# EAGLE design PCB-wPAWS-0.1 (EAGLE 9.6.2)
IGNORE_RENUMBER: TP
Assembly variants: LED DISPLAY, LED CIRCLE, Powered, PRO_C, BASIC, PRO_MICRO

## Sheet 1 of 2
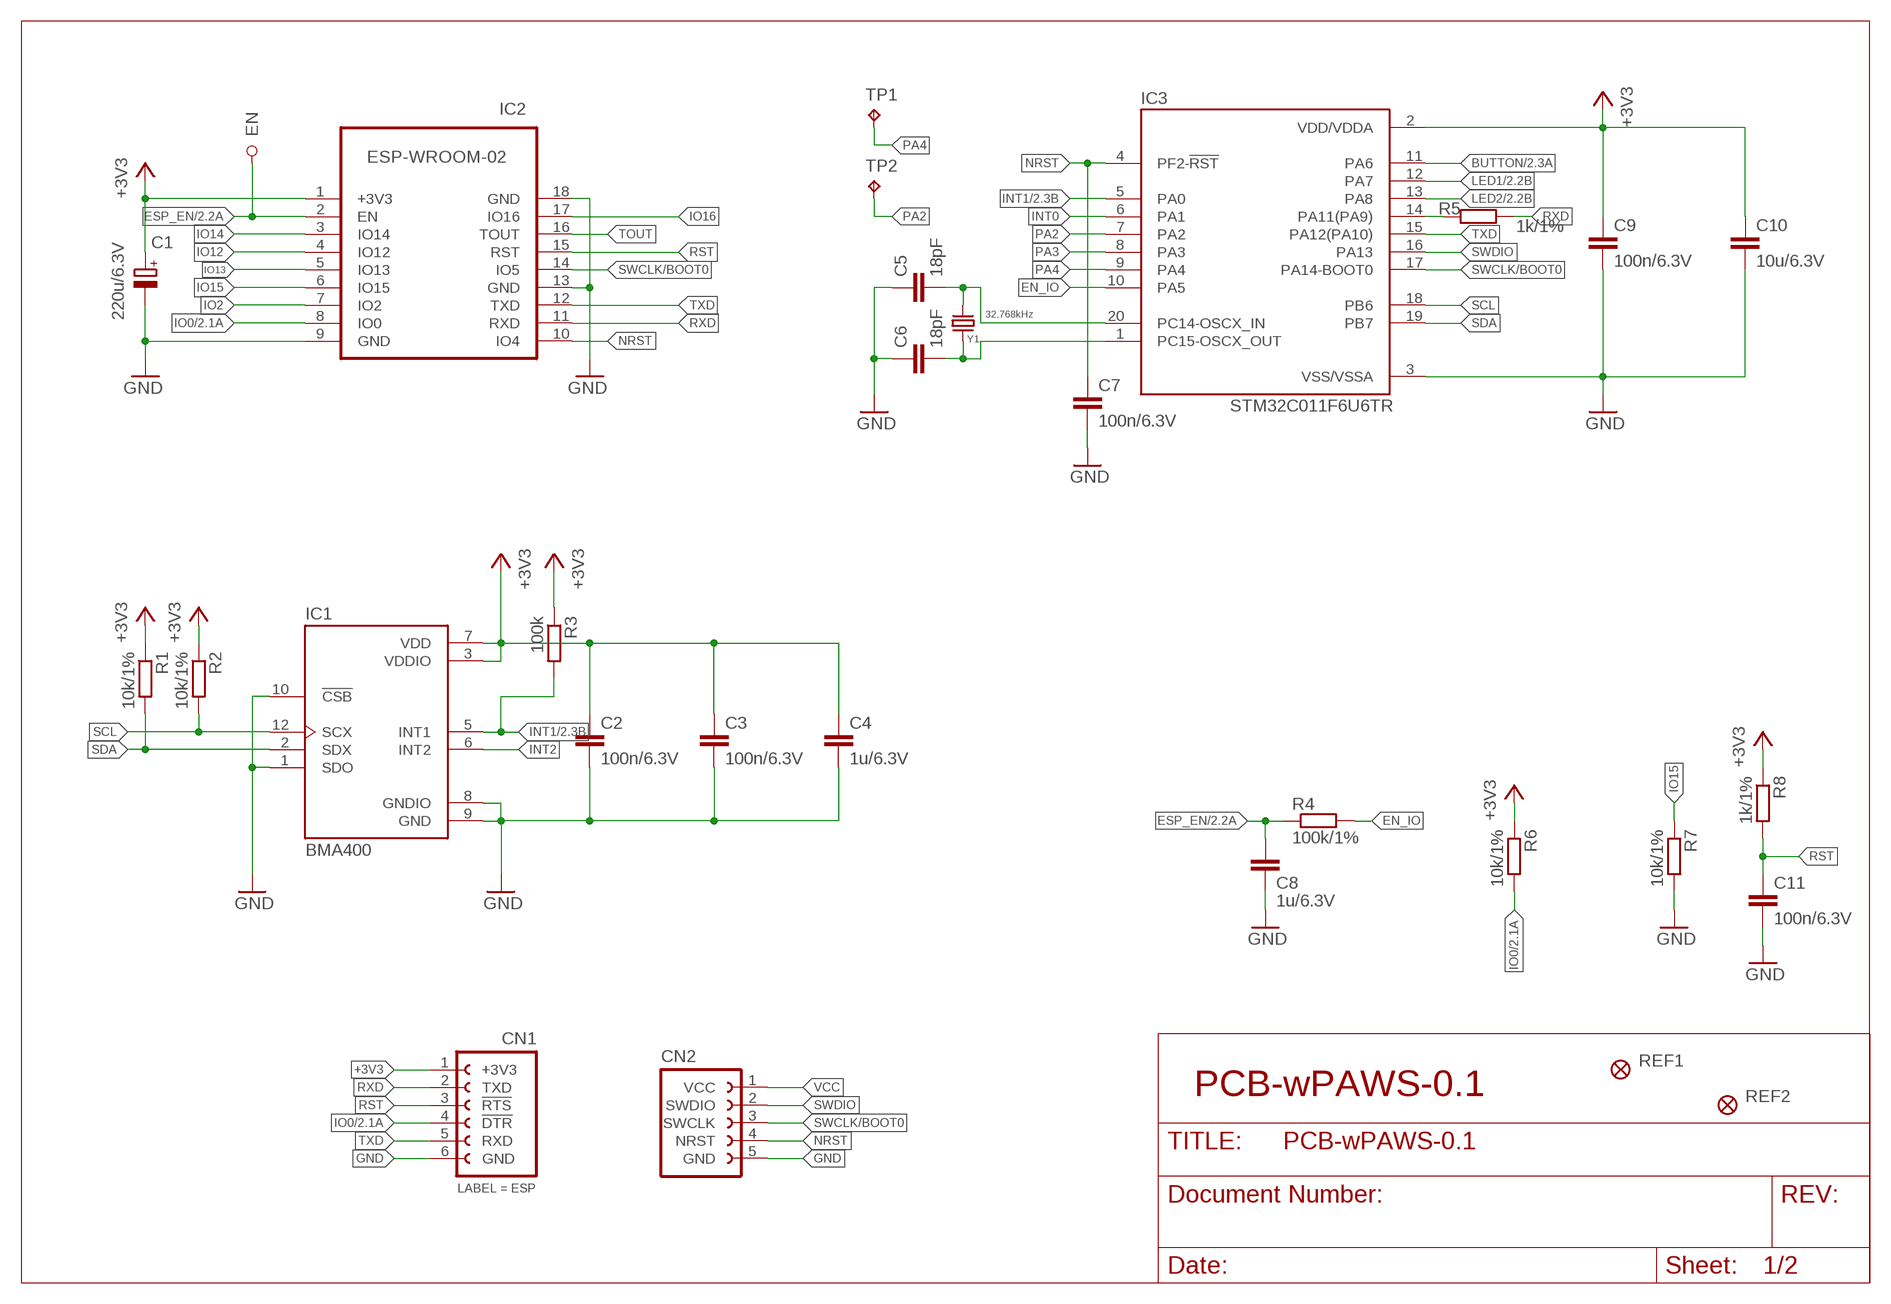
[diagram p0: schematic, sheet 1]

### Parts
C1  220u/6.3V  CPOL-EUSMCC  [SMC_C]
C2  100n/6.3V  C0402  [C0402]
C3  100n/6.3V  C0402  [C0402]
C4  1u/6.3V  C0402  [C0402]
C5  18pF  C0402  [C0402]
C6  18pF  C0402  [C0402]
C7  100n/6.3V  C0402  [C0402]
C8  1u/6.3V  C0402  [C0402]
C9  100n/6.3V  C0402  [C0402]
C10  10u/6.3V  C0402  [C0402]
C11  100n/6.3V  C0402  [C0402]
CN1  KOSMOPOLCENTERING-PADS  [6P-2.54-CENTERING-HOLE-PAD]
CN2  SWD2SIDE-CENTRING  [FE05W-SWD-CP]
IC1  BMA400  [XDCR_BMA400]
IC2  ESP-WROOM-02  ESP-WROOM-02D-32MBIT  [MODULE]
IC3  STM32C011F6U6TR  [IC_STM32C011F6U6TR]
JP1  PINHD-1X1  [1X01]
R1  10k/1%  R0402  [R0402]
R2  10k/1%  R0402  [R0402]
R3  100k  R0402  [R0402]
R4  100k/1%  R0402  [R0402]
R5  1k/1%  R0402  [R0402]
R6  10k/1%  R0402  [R0402]
R7  10k/1%  R0402  [R0402]
R8  1k/1%  R0402  [R0402]
REF1  FIDUCIAL-CLEAR  [FIDUCIAL-ANDPOL]
REF2  FIDUCIAL-CLEAR  [FIDUCIAL-ANDPOL]
TP1  TPB1,27  [B1,27]
TP2  TPB1,27  [B1,27]
Y1  32.768kHz  WE-XTAL_CFPX-217_830009706  [WE-XTAL_CFPX-217]

### Nets
+3V3: C1.+ C2.1 C3.1 C4.1 C9.1 C10.1 CN1.1(+3V3) IC1.3(VDDIO) IC1.7(VDD) IC2.1(+3V3) IC3.2(VDD/VDDA) R1.1 R2.1 R3.1 R6.1 R8.1 ; also sheet 2
BUTTON: IC3.11(PA6) ; also sheet 2
EN_IO: IC3.10(PA5) R4.2
ESP_EN: C8.1 IC2.2(EN) JP1.1 R4.1 ; also sheet 2
GND: C1.- C2.2 C3.2 C4.2 C5.1 C6.1 C7.2 C8.2 C9.2 C10.2 C11.2 CN1.6(GND) CN2.5(GND) IC1.1(SDO) IC1.8(GNDIO) IC1.9(GND) IC1.10(!CSB) IC2.9(GND) IC2.13(GND) IC2.18(GND) IC3.3(VSS/VSSA) R7.2 ; also sheet 2
INT0: IC3.6(PA1)
INT1: IC1.5(INT1) IC3.5(PA0) R3.2 ; also sheet 2
INT2: IC1.6(INT2)
IO0: CN1.4(!DTR) IC2.8(IO0) R6.2 ; also sheet 2
IO2: IC2.7(IO2)
IO12: IC2.4(IO12)
IO13: IC2.5(IO13)
IO14: IC2.3(IO14)
IO15: IC2.6(IO15) R7.1
IO16: IC2.17(IO16)
LED1: IC3.12(PA7) ; also sheet 2
LED2: IC3.13(PA8) ; also sheet 2
N$4: C6.2 IC3.1(PC15-OSCX_OUT) Y1.1
NRST: C7.1 CN2.4(NRST) IC2.10(IO4) IC3.4(PF2-!RST)
PA2: IC3.7(PA2) TP2.TP
PA3: IC3.8(PA3)
PA4: IC3.9(PA4) TP1.TP
PC14-OSCX_IN: C5.2 IC3.20(PC14-OSCX_IN) Y1.2
RST: C11.1 CN1.3(!RTS) IC2.15(RST) R8.2
RXD: CN1.2(TXD) IC2.11(RXD) R5.2
SCL: IC1.12(SCX) IC3.18(PB6) R2.2
SDA: IC1.2(SDX) IC3.19(PB7) R1.2
STM_RXD: IC3.14(PA11(PA9)) R5.1
SWCLK/BOOT0: CN2.3(SWCLK) IC2.14(IO5) IC3.17(PA14-BOOT0)
SWDIO: CN2.2(SWDIO) IC3.16(PA13)
TOUT: IC2.16(TOUT)
TXD: CN1.5(RXD) IC2.12(TXD) IC3.15(PA12(PA10))
VCC: CN2.1(VCC)

## Sheet 2 of 2
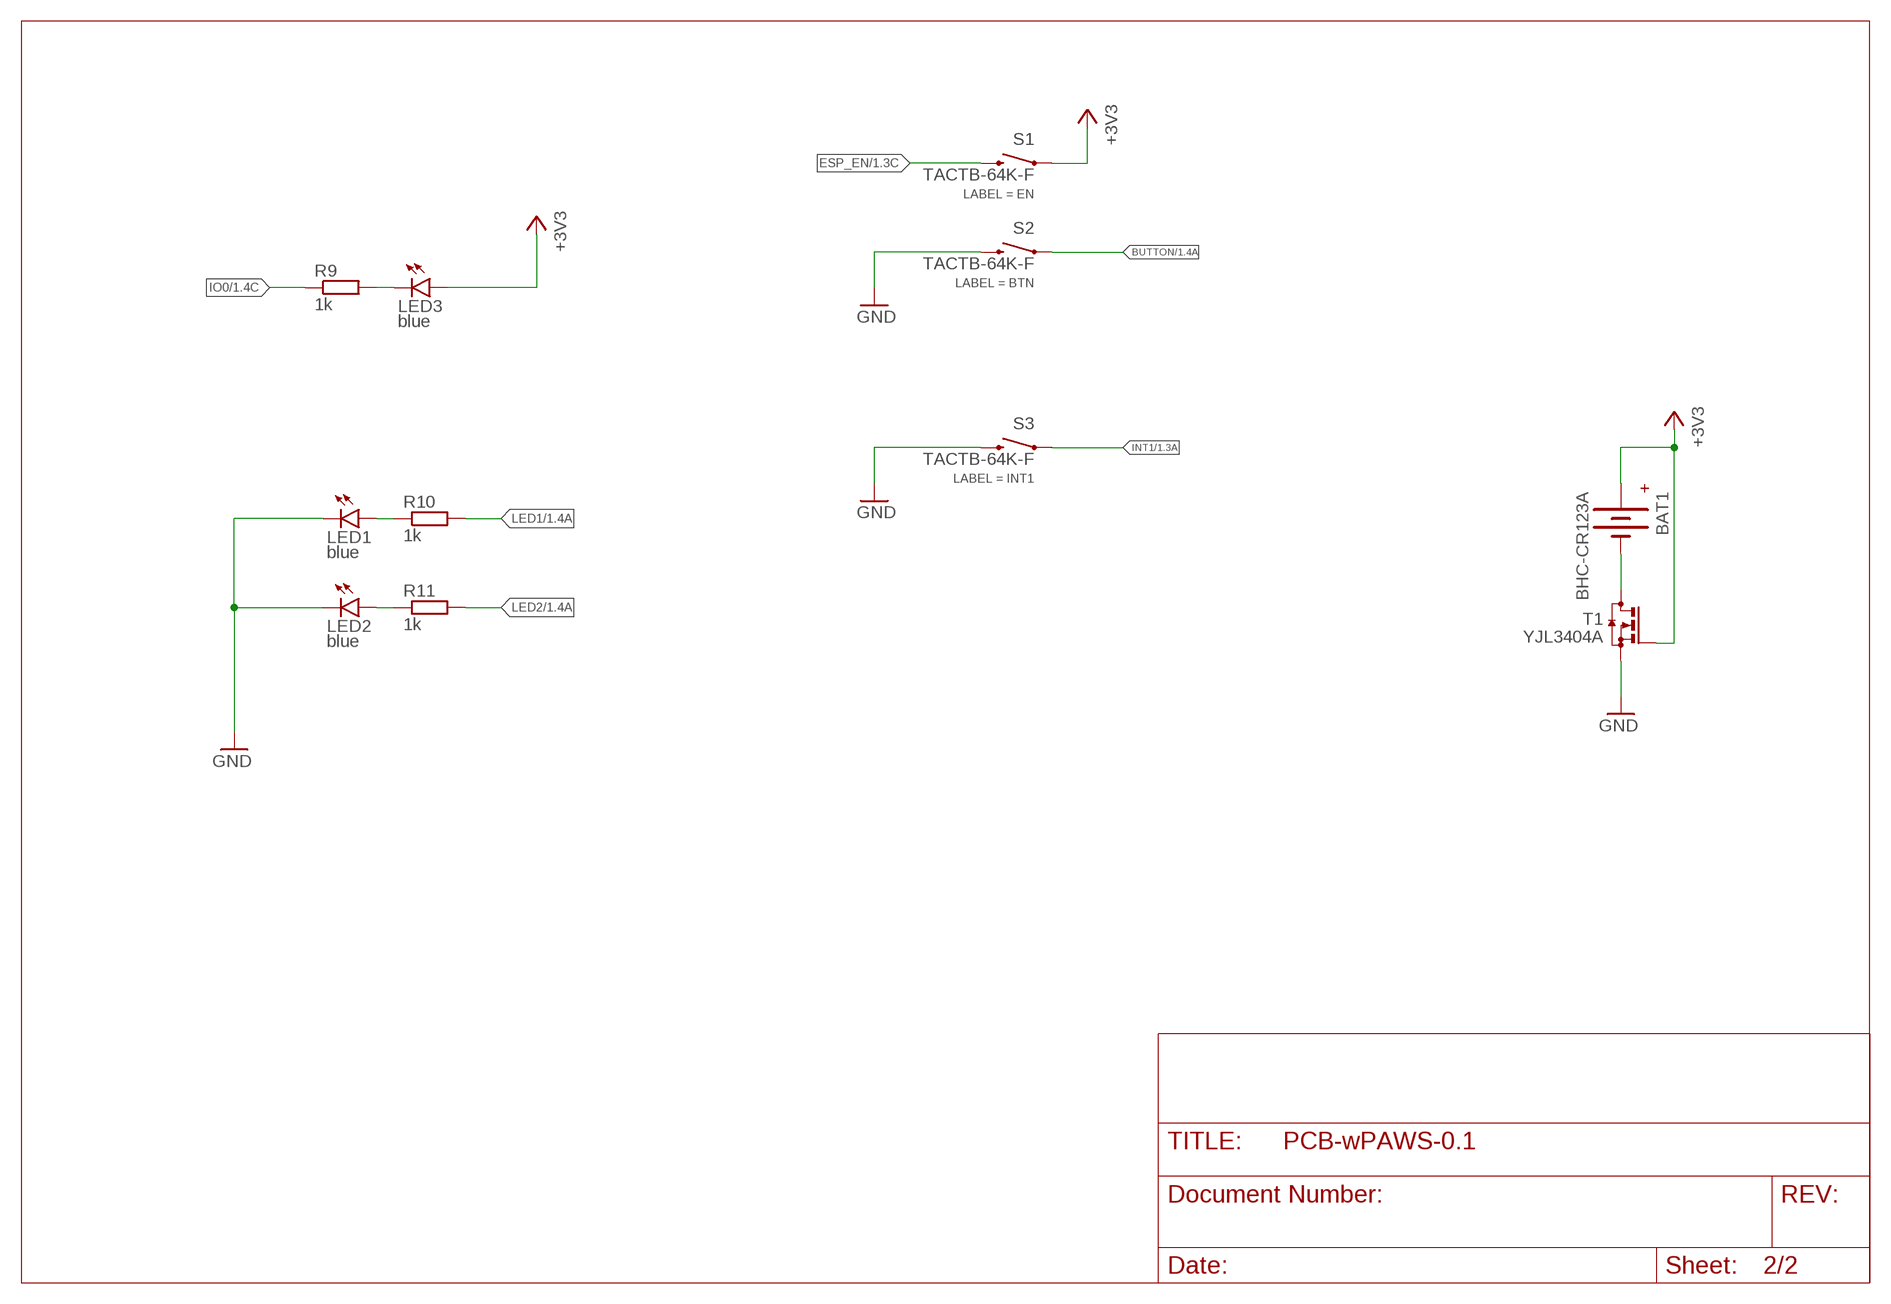
[diagram p1: schematic, sheet 2]

### Parts
BAT1  BHC-CR123A  BATTERYBHC-CR123A  [BHC-CR123A]
LED1  blue  LEDCHIPLED_0603  [CHIPLED_0603]  (not fitted in variant PRO_C)  (not fitted in variant BASIC)  (not fitted in variant PRO_MICRO)
LED2  blue  LEDCHIPLED_0603  [CHIPLED_0603]  (not fitted in variant PRO_C)  (not fitted in variant BASIC)  (not fitted in variant PRO_MICRO)
LED3  blue  LEDCHIPLED_0603  [CHIPLED_0603]  (not fitted in variant PRO_C)  (not fitted in variant BASIC)  (not fitted in variant PRO_MICRO)
R9  1k  R0402  [R0402]
R10  1k  R0402  [R0402]
R11  1k  R0402  [R0402]
S1  TACTB-64K-F  SWITCH-MOMENTARY-2SMD  [TACTILE-SWITCH-SMD]
S2  TACTB-64K-F  SWITCH-MOMENTARY-2SMD  [TACTILE-SWITCH-SMD]
S3  TACTB-64K-F  SWITCH-MOMENTARY-2SMD  [TACTILE-SWITCH-SMD]
T1  YJL3404A  MOSFET-N-SOT23  [SOT23-R_INFINEON]

### Nets
+3V3: BAT1.VCC(+) LED3.A S1.1 T1.1(G) ; also sheet 1
BUTTON: S2.1 ; also sheet 1
ESP_EN: S1.3 ; also sheet 1
GND: LED1.C LED2.C S2.3 S3.3 T1.2(S) ; also sheet 1
INT1: S3.1 ; also sheet 1
IO0: R9.1 ; also sheet 1
LED1: R10.2 ; also sheet 1
LED2: R11.2 ; also sheet 1
LED3C: LED3.C R9.2
N$1: BAT1.GND(-) T1.3(D)
N$2: LED2.A R11.1
N$3: LED1.A R10.1

## Library data of the parts
BAT1 = blebox-battery:BATTERY: Battery Holders Various common sizes : AA, AAA, 18650 (PRT-12895), 20mm coin cell and 12mm coin cell. 20MM_4LEGS, BATT-10373; OC_TME: BHC-CR123A; OC_TME_BATTERY: BAT-CR123/VA-BULK; PRICE_PLN: 1
C1 = rcl:CPOL-EU: POLARIZED CAPACITOR, European symbol; SPICEPREFIX: C
C2-C11 = blebox-rcl:C; PRICE_PLN: 0,02
CN1 = blebox-pinhead:KOSMOPOL: FEMALE HEADER; LABEL: ESP
CN2 = blebox-pinhead:SWD: FEMALE HEADER
IC1 = blebox-ic:BMA400; AVAILABILITY: Unavailable; DESCRIPTION: Accelerometer X, Y, Z Axis ±2g, 4g, 8g, 16g 12-LGA _2x2_; MF: Bosch Sensortec; MP: BMA400; PACKAGE: LGA-12 Bosch Tools; PRICE: None
IC2 = blebox-esp-wroom-02:ESP-WROOM-02: WiFi module - ESP-WROOM-02D 32MBit flash; OC_TME: ESP-WROOM-02; PRICE_PLN: 8,5
IC3 = blebox-ic:STM32C011F6U6TR; MANUFACTURER: STMicroelectronics; MAXIMUM_PACKAGE_HEIGHT: 0.6mm; PARTREV: 3; STANDARD: Manufacturer Recommendations
JP1 = blebox-pinhead:PINHD-1X1: PIN HEADER; TP_SIGNAL_NAME: EN
LED1-LED3 = led:LED: LED OSRAM: - CHIPLED LG R971, LG N971, LY N971, LG Q971, LY Q971, LO R971, LY R971 LH N974, LH R974 LS Q976, LO Q976, LY Q976 LO Q996 - Hyper CHIPLED LW Q18S LB Q993, LB Q99A, LB R99A - SideLED LS A670, LO A670, LY A670, LG A670, LP A670 LB A673, LV A673, LT A673, LW A673 LH A674 LY A675 LS A676, LA A676, LO A676, LY A676, LW A676 LS A679, LY A679, LG A679 - Hyper Micro SIDELED® LS Y876, LA Y876, LO Y876, LY Y876 LT Y87S - SmartLED LW L88C, LW L88S LB L89C, LB L89S, LG L890 LS L89K, LO L89K, LY L89K LS L896, LA L896, LO L896, LY L896 - TOPLED LS T670, LO T670, LY T670, LG T670, LP T670 LSG T670, LSP T670, LSY T670, LOP T670, LYG T670 LG T671, LOG T671, LSG T671 LB T673, LV T673, LT T673, LW T673 LH T674 LS T676, LA T676, LO T676, LY T676, LB T676, LH T676, LSB T676, LW T676 LB T67C, LV T67C, LT T67C, LS T67K, LO T67K, LY T67K, LW E67C LS E67B, LA E67B, LO E67B, LY E67B, LB E67C, LV E67C, LT E67C LW T67C LS T679, LY T679, LG T679 LS T770, LO T770, LY T770, LG T770, LP T770 LB T773, LV T773, LT T773, LW T773 LH T774 LS E675, LA E675, LY E675, LS T675 LS T776, LA T776, LO T776, LY T776, LB T776 LHGB T686 LT T68C, LB T68C - Hyper Mini TOPLED® LB M676 - Mini TOPLED Santana® LG M470 LS M47K, LO M47K, LY M47K Source: http://www.osram.convergy.de LUXEON: - LUMILED® LXK2-PW12-R00, LXK2-PW12-S00, LXK2-PW14-U00, LXK2-PW14-V00 LXK2-PM12-R00, LXK2-PM12-S00, LXK2-PM14-U00 LXK2-PE12-Q00, LXK2-PE12-R00, LXK2-PE12-S00, LXK2-PE14-T00, LXK2-PE14-U00 LXK2-PB12-K00, LXK2-PB12-L00, LXK2-PB12-M00, LXK2-PB14-N00, LXK2-PB14-P00, LXK2-PB14-Q00 LXK2-PR12-L00, LXK2-PR12-M00, LXK2-PR14-Q00, LXK2-PR14-R00 LXK2-PD12-Q00, LXK2-PD12-R00, LXK2-PD12-S00 LXK2-PH12-R00, LXK2-PH12-S00 LXK2-PL12-P00, LXK2-PL12-Q00, LXK2-PL12-R00 Source: www.luxeon.com KINGBRIGHT: KA-3528ASYC Source: www.kingbright.com
R1-R11 = blebox-rcl:R; PRICE_PLN: 0,01
REF1 REF2 = blebox-fiducial:FIDUCIAL: Fiducial Alignment Points Various fiducial points for machine vision alignment.
S1 = SparkFun-Electromechanical:SWITCH-MOMENTARY-2: Various NO switches- pushbuttons, reed, etc; LABEL: EN; OC_TME: TACTB-64K-F; PRICE_PLN: 0,55
S2 = SparkFun-Electromechanical:SWITCH-MOMENTARY-2: Various NO switches- pushbuttons, reed, etc; LABEL: BTN; OC_TME: TACTB-64K-F; PRICE_PLN: 0,55
S3 = SparkFun-Electromechanical:SWITCH-MOMENTARY-2: Various NO switches- pushbuttons, reed, etc; LABEL: INT1; OC_TME: TACTB-64K-F; PRICE_PLN: 0,55
T1 = blebox-transistor:MOSFET-N-; OC_TME: YJL3404A-YAN; PRICE_PLN: 0,15
TP1 TP2 = blebox-testpad:TP: Test pad
Y1 = Wurth_Quartz Crystals & Oscillators_WE-XTAL:WE-XTAL_CFPX-217: WE-XTAL Watch Crystals Characteristics SMT and THT models Hermetically sealed Frequency: 32.768 kHz Tolerances down to ±10 ppm available Characteristics Microprocessor Real Time Clocks Test and Measurement Equipment Battery powered Applications <https://www.we-online.com/catalog/media/o162740v209%20Family_WE-XTAL_WatchCrystal.jpg> Details see: https://www.we-online.com/catalog/en/WE-XTAL_WATCHCRYSTAL Updated by Ella Wu, 2020-10-30 2020 (C) Wurth Elektronik; C-LOAD: 9pF; DATASHEET-URL: https://www.we-online.com/catalog/datasheet/830009706.pdf; MOUNT: SMT; PART-NUMBER: 830009706; TOLERANCE: ±20ppm

## Board
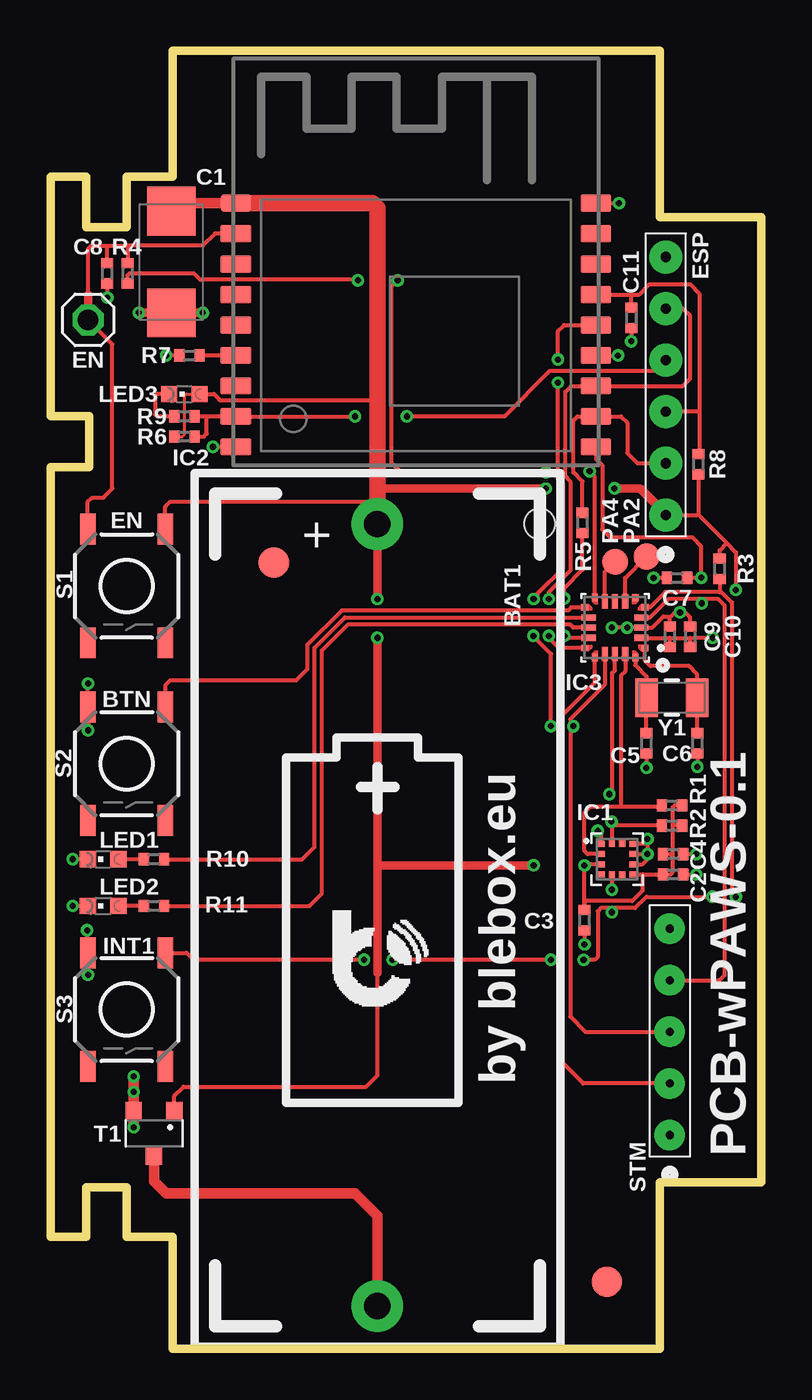
[diagram p2: board, top side]
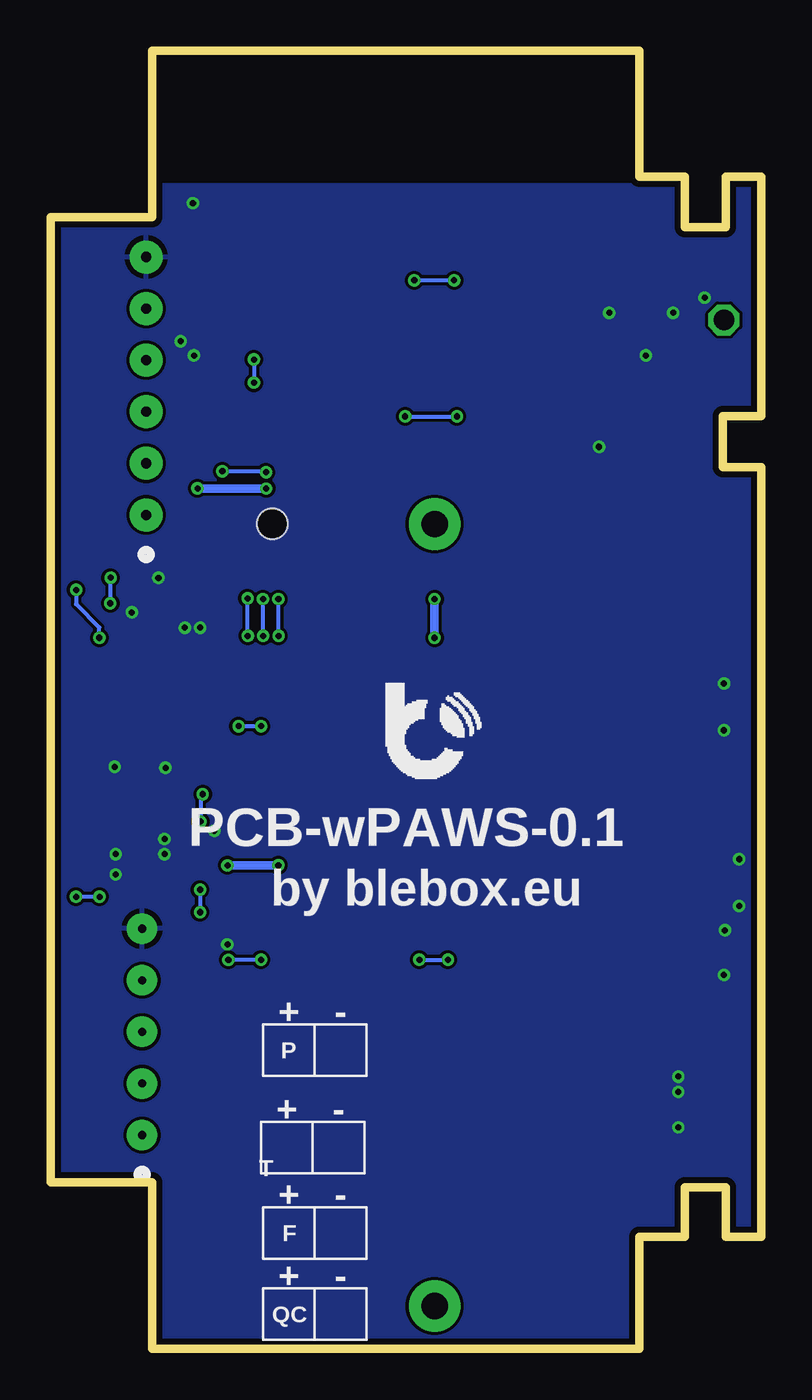
[diagram p3: board, bottom side, seen from below]

Size 34.98 x 63.9 mm. Coordinates in mm from the lower left corner, seen from the top.
Outline: 6,0 29.98,0 29.98,8.2 34.98,8.2 34.98,55.7 29.98,55.7 29.98,63.9 6,63.9 6,57.71 3.75,57.71 3.75,55.21 1.75,55.21 1.75,57.71 0,57.71 0,45.91 1.9,45.91 1.9,43.41 0,43.41 0,5.5 1.75,5.5 1.75,7.96 3.75,7.96 3.75,5.5 6,5.5 6,0
Copper layers (1*16): Top 0.035mm / dielectric 1.5mm / Bottom 0.035mm
Design rules "pcbway": minimum track width 6mil, minimum drill 0.3mm, track to track 6mil, track to pad 6mil, pad to pad 6mil, via to via 6mil, smd to smd 6mil, copper to edge 0.001mm, drill to drill 8mil, minimum pad ring 6mil, minimum via ring 6mil, stop-mask expansion 0mil, vias tented up to drill 999mil, thermal gap 10mil
tRestrict: 24 lines
bRestrict: 24 lines

### Footprints (pad centres in the part's own frame; a part is rotated, then mirrored left to right if it is on the bottom)
BHC-CR123A = drill 1.3 pad 2.54: GND 19,0; VCC -19.5,0 | hole 1.5: -19.5,8
SMC_C = smd 2.4 x 2.4: + -2.5,0; - 2.5,0
C0402 = smd 0.5 x 0.6: 1 -0.5,0; 2 0.5,0
6P-2.54-CENTERING-HOLE-PAD = drill 0.5 pad 1.626: 1 -6.35,0; 2 -3.81,0; 3 -1.27,0; 4 1.27,0; 5 3.81,0; 6 6.35,0
FE05W-SWD-CP = drill 0.4 pad 1.5: 1 -5.08,0; 2 -2.54,0; 3 0,0; 4 2.54,0; 5 5.08,0
XDCR_BMA400 = smd 0.35 x 0.3: 1 -0.775,0.75; 2 -0.775,0.25; 3 -0.775,-0.25; 4 -0.775,-0.75; 7 0.775,-0.75; 8 0.775,-0.25; 9 0.775,0.25; 10 0.775,0.75 | smd 0.3 x 0.35: 5 -0.25,-0.775; 6 0.25,-0.775; 11 0.25,0.775; 12 -0.25,0.775
MODULE = smd 1.5 x 0.85: 1 -8.87,4.9; 2 -8.87,3.4; 3 -8.87,1.9; 4 -8.87,0.4; 5 -8.87,-1.1; 6 -8.87,-2.6; 7 -8.87,-4.1; 8 -8.87,-5.6; 9 -8.87,-7.1; 10 8.87,-7.1; 11 8.87,-5.6; 12 8.87,-4.1; 13 8.87,-2.6; 14 8.87,-1.1; 15 8.87,0.4; 16 8.87,1.9; 17 8.87,3.4; 18 8.87,4.9
IC_STM32C011F6U6TR = smd 0.35 x 0.3: 1 -1.475,1; 5 -1.475,-1; 11 1.475,-1; 15 1.475,1 | smd 0.7 x 0.3: 2 -1.3,0.5; 3 -1.3,0; 4 -1.3,-0.5; 12 1.3,-0.5; 13 1.3,0; 14 1.3,0.5 | smd 0.3 x 0.35: 6 -1,-1.475; 10 1,-1.475; 16 1,1.475; 20 -1,1.475 | smd 0.3 x 0.7: 7 -0.5,-1.3; 8 0,-1.3; 9 0.5,-1.3; 17 0.5,1.3; 18 0,1.3; 19 -0.5,1.3
1X01 = drill 1.016 octagon: 1 0,0
CHIPLED_0603 = smd 0.8 x 0.8: A 0,-0.75; C 0,0.75
R0402 = smd 0.5 x 0.6: 1 -0.5,0; 2 0.5,0
FIDUCIAL-ANDPOL = smd 1.5 x 1.5: 1 0,0
TACTILE-SWITCH-SMD = smd 1.524 x 0.762: 1 -2.794,1.905; 2 2.794,1.905; 3 -2.794,-1.905; 4 2.794,-1.905
SOT23-R_INFINEON = smd 0.8 x 0.9: 1 -1,-1.1; 2 1,-1.1; 3 0,1.1
B1,27 = smd 1.27 x 1.27: TP 0,0
WE-XTAL_CFPX-217 = smd 1.1 x 1.9: 1 -1.25,0; 2 1.25,0

### Placement (x,y rotation side)
BAT1  16.09,21.1 270 top
C1  5.94,53.5 270 top
C2  30.63,23.35 0 top
C3  26.29,21.1 270 top
C4  30.63,24.35 0 top
C5  29.34,29.8 90 top
C6  31.84,29.8 90 top
C7  30.84,37.95 180 top
C8  2.78,52.95 270 top
C9  30.48,35.05 90 top
C10  31.48,35.05 90 top
C11  28.59,50.75 270 top
CN1  30.29,47.4 90 top
CN2  30.48,15.6 90 top
F  [MANUFACTURING-TEST]  21.98,5.7 0 bottom
IC1  27.88,24.1 0 top
IC2  17.98,51.5 0 top
IC3  27.79,35.5 180 top
JP1  1.84,50.65 0 top
LED1  2.58,24.1 90 top
LED2  2.58,21.8 90 top
LED3  6.58,47 90 top
P  [MANUFACTURING-TEST]  21.98,14.7 0 bottom
QC  [MANUFACTURING-TEST]  21.98,1.7 0 bottom
R1  30.59,26.75 180 top
R2  30.59,25.75 180 top
R3  32.94,38.4 270 top
R4  3.78,52.95 270 top
R5  26.18,40.65 90 top
R6  6.58,44.9 0 top
R7  6.83,48.9 180 top
R8  31.88,43.55 90 top
R9  6.58,45.9 180 top
R10  5.08,24.1 0 top
R11  5.08,21.8 0 top
REF1  27.38,3.3 270 top
REF2  10.98,38.7 90 top
S1  3.73,37.55 270 top
S2  3.73,28.8 270 top
S3  3.73,16.7 270 top
T  [MANUFACTURING-TEST]  22.09,9.9 0 bottom
T1  5.08,10.6 180 top
TP1  27.79,38.75 0 top
TP2  29.34,39 0 top
U$1  [BLEBOX-LOGO-MEDIUM]  15.98,29.7 0 bottom
U$4  [BLEBOX-LOGO-MEDIUM]  16.38,18.5 0 top
Y1  30.59,32.05 180 top

### Tracks (layer width: path | path; a pad name or v marks a point on that pad's centre or on a via)
+3V3  (via drill 0.3)
  Top 0.152: R6.1 6.49,44.9 6.58,45 6.58,46.9 6.69,47 LED3.A
  Top 0.2: IC1.7 29.13,23.35 | 29.13,23.35 C2.1 30.53,23.35 30.63,23.45 30.63,24.35 | IC1.3 26.34,23.85 v26.29,23.79 C3.1 26.29,22.04 28.63,22.04 29.13,22.55 29.13,23.35 | 30.63,24.35 30.63,25.75 | 30.63,25.75 30.63,26.65 30.73,26.75 R1.1 | C4.1 30.63,24.35 | R2.1 30.63,25.75 | v32.59,35 31.69,35 | v33.73,37.36 33.73,39.21 33.29,39.65 | 33.29,39.65 31.86,41.08 | 31.86,41.08 31.84,41.05 CN1.1 | R3.1 32.94,39.3 33.29,39.65 | T1.1 6.08,12.45 6.54,12.9 15.54,12.9 16.09,13.45 16.09,18.5 | R8.1 31.88,41.1 31.86,41.08 | LED3.A 8.03,47 8.31,46.72 8.33,46.7 15.88,46.7 16.09,46.9 | S1.1 5.64,41.46 5.89,41.7 14.98,41.7 15.18,41.7 16.09,41.7
  Top 0.203: IC3.2 30.48,35 | 30.48,35 31.48,35 | 31.48,35 31.69,35 | C9.1 30.48,35 | C10.1 31.48,35
  Top 0.406: 16.09,23.8 v23.78,23.8 | CN1.1 30.29,41.1 29.03,42.36 v27.76,42.36 | v24.38,42.35 16.09,42.35 16.09,41.7 BAT1.VCC | 16.09,18.5 16.09,23.8 | 16.09,23.8 v16.09,35 | v16.09,36.91 16.09,40.7
  Top 0.508: C1.+ 6.33,56.4 IC2.1
  Top 0.813: IC2.1 15.83,56.4 16.09,56.15 16.09,46.9 16.09,41.7 16.09,40.7 BAT1.VCC
  Bottom 0.2: v23.79,23.79 v23.78,23.8 | v33.73,37.36 33.73,36.66 32.59,35.52 v32.59,35
  Bottom 0.406: v26.29,23.79 v23.79,23.79 | v27.76,42.36 v27.75,42.35 v24.38,42.35 | v16.09,35 v16.09,36.91
BUTTON
  Top 0.2: IC3.11 25.63,36.5 25.49,36.35 14.34,36.35 12.63,34.65 12.63,33.45 12.08,32.9 5.89,32.9 5.64,32.66 S2.1
EN_IO  (via drill 0.3)
  Top 0.2: IC3.10 26.79,42.95 v26.54,43.2 | v24.38,43.15 17.24,43.15 16.79,43.6 16.79,52.3 v17.09,52.6 | v15.12,52.6 v15.12,52.61 15.1,52.63 7.36,52.63 7.04,52.95 3.88,52.95 3.78,52.85 R4.2
  Bottom 0.2: v26.54,43.2 24.43,43.2 v24.38,43.15 | v17.09,52.6 v15.12,52.6
ESP_EN
  Top 0.2: IC2.2 8.08,54.9 7.49,54.3 3.78,54.3 | 3.78,54.3 R4.1 | C8.1 2.78,54.3 3.03,54.3 3.78,54.3 | S1.3 1.83,41.7 2.03,41.9 2.58,41.9 3.03,42.35 3.03,49.45 JP1.1
  Top 0.203: 1.84,51.9 1.84,54.15 1.99,54.3 3.03,54.3
  Top 0.406: JP1.1 1.84,51.9
GND  (via drill 0.3)
  Top 0.2: C6.1 v31.84,28.65 | C5.1 v29.34,28.6 | C3.2 v26.29,19.9 | C2.2 v31.79,23.35 | C4.2 v31.79,24.35 | IC1.1 27.11,25.32 v26.93,25.5 | IC1.10 29.38,24.85 v29.38,25.1 v29.38,24.35 | IC1.9 v29.38,24.35 | IC1.8 29.13,23.85 29.38,24.1 v29.38,24.35 | C7.2 v29.68,37.95 | LED2.C v1.09,21.8 | LED1.C v1.09,24.1 | v1.79,20.6 1.83,20.55 S3.3 v1.83,18.4 v1.84,18.4 | v1.84,30.45 S2.3 v1.83,32.75 v1.84,32.75 | IC2.13 v27.93,48.9 | IC2.18 v27.98,56.4 | IC2.9 v7.99,44.4 | v28.38,35.5 v27.63,35.5 | IC3.3 29.62,35.5 30.17,36.05 30.54,36.05 30.48,35.99 | C10.2 31.48,36.01 31.24,36.25 v30.99,36.25 | C11.2 v28.59,49.6 | R7.2 v5.69,48.9 | C8.2 v2.78,51.75
  Top 0.203: IC3.3 v28.38,35.5 | C9.2 30.48,35.99 | v30.99,36.25 30.74,36.25 30.54,36.05
  Top 0.406: v4.33,51 C1.- v7.49,51
  Top 0.508: v4.08,13.4 v4.08,12.65 T1.2 v4.08,10.9
  pour Bottom: -0.01,57.3 34.98,57.3 34.98,-0.3 -0.01,-0.3
INT1  (via drill 0.3)
  Top 0.2: IC1.5 v27.63,22.6 | v27.63,21.49 27.63,21.69 | 27.63,21.69 28.77,21.69 29.34,22.25 v32.59,22.25 | v33.74,22.25 33.54,22.45 33.54,36.74 33.03,37.25 32.94,37.25 | IC3.5 29.51,36.5 30.26,37.25 30.7,37.25 32.94,37.25 | S3.1 6.69,19.49 6.74,19.45 7.03,19.15 v15.43,19.15 | 27.63,21.69 27.09,21.69 26.93,21.54 26.93,19.29 26.79,19.14 v26.24,19.14 | R3.2 32.94,37.25 | v24.63,19.15 v16.84,19.15
  Bottom 0.2: v27.63,22.6 v27.63,21.49 | v32.59,22.25 v33.74,22.25 | v24.63,19.15 v26.23,19.15 v26.24,19.14 | v16.84,19.15 v15.43,19.15
IO0  (via drill 0.3)
  Top 0.2: v14.98,45.9 IC2.8 7.69,45.9 | v17.54,45.9 22.34,45.9 24.59,48.15 29.77,48.15 CN1.4 | 7.69,45.9 R9.1 | R6.2 7.54,44.9 7.69,45.05 7.69,45.9
  Bottom 0.2: v17.54,45.9 v14.98,45.9
IO15
  Top 0.2: IC2.6 R7.1
LED1
  Top 0.2: R10.2 12.38,24.1 12.98,24.7 12.98,34.5 14.48,36 IC3.12
LED2
  Top 0.2: R11.2 12.73,21.8 13.36,22.42 13.36,34.38 14.63,35.65 25.59,35.65 25.73,35.5 IC3.13
LED3C
  Top 0.2: R9.2 5.24,45.9 5.14,46 5.14,46.9 5.24,47 LED3.C
N$1
  Top 0.508: T1.3 5.08,8.25 5.69,7.65 14.98,7.65 16.09,6.55 BAT1.GND
N$2
  Top 0.2: R11.1 LED2.A
N$3
  Top 0.2: R10.1 LED1.A
N$4
  Top 0.2: IC3.1 29.26,33.88 29.54,33.6 31.43,33.6 31.84,33.2 Y1.1 C6.2
NRST  (via drill 0.3)
  Top 0.2: CN2.4 32.92,18.14 33.19,18.4 33.19,36.6 32.88,36.9 31.98,36.9 | 31.98,36.9 30.41,36.9 | 31.98,36.9 32.06,36.83 v32.06,36.7 | C7.1 v32.03,37.95 v32.03,37.96 32.03,39.5 31.59,39.95 27.54,39.95 27.16,40.33 27.16,43.5 26.86,43.8 IC2.10
  Top 0.203: IC3.4 29.51,36 30.41,36.9
  Bottom 0.2: v32.06,36.7 32.03,36.72 v32.03,37.96
PA2
  Top 0.203: IC3.7 28.29,37.95 TP2.TP
PA4
  Top 0.203: IC3.9 27.29,38.25 TP1.TP
PC14-OSCX_IN
  Top 0.2: IC3.20 28.79,33.65 29.34,33.1 29.34,32.45 Y1.2 C5.2
RST
  Top 0.2: IC2.15 28.59,51.9 | 28.59,51.9 28.98,51.9 29.48,52.4 31.48,52.4 31.93,51.95 31.93,46.13 | 31.93,46.13 CN1.3 | C11.1 28.59,51.9 | 31.93,46.13 31.93,44.1 R8.2
RXD
  Top 0.2: 28.38,44.1 28.38,45.6 28.09,45.9 IC2.11 25.93,45.9 25.73,45.7 25.73,43.15 26.18,42.7 R5.2
  Top 0.203: CN1.2 28.89,43.59 28.38,44.1
SCL  (via drill 0.3)
  Top 0.152: v27.62,25.95 27.63,25.93 27.63,25.88
  Top 0.2: v27.5,27.3 27.65,27.45 27.65,33.27 27.79,33.4 IC3.18 | 27.63,25.88 IC1.12 | R2.2 27.67,25.75 27.67,25.9 v27.62,25.95
  Bottom 0.2: v27.5,27.3 27.62,27.19 v27.62,25.95
SDA
  Top 0.2: IC1.2 26.43,24.35 26.29,24.5 26.29,26.4 26.59,26.7 28.09,26.7 | IC3.19 28.29,33.35 28.09,33.15 28.09,26.7 | R1.2 30.04,26.7 28.09,26.7
STM_RXD  (via drill 0.3)
  Top 0.2: R5.1 26.18,38.35 25.29,37.46 v25.29,36.94 | IC3.14 25.38,35 v25.29,35.09
  Bottom 0.2: v25.29,35.09 v25.29,36.94
SWCLK/BOOT0  (via drill 0.3)
  Top 0.2: IC3.17 27.29,32.7 25.59,31 25.59,30.5 | 25.59,30.5 25.59,16.35 26.34,15.6 CN2.3 | 25.59,30.5 v25.74,30.65 | v23.77,35.09 23.97,34.89 23.97,34.86 24.63,34.21 v24.63,30.65 | v23.78,36.91 23.98,37.11 23.98,37.19 25.23,38.45 25.23,42.55 24.98,42.8 v24.98,47.55 v24.98,47.56 | v24.98,48.71 24.98,50.09 25.29,50.4 IC2.14
  Bottom 0.2: v25.74,30.65 v24.63,30.65 | v23.77,35.09 v23.77,36.9 v23.78,36.91 | v24.98,48.71 v24.98,47.56
SWDIO
  Top 0.2: CN2.2 26.22,13.06 25.18,14.1 25.18,31.2 26.79,32.8 IC3.16
TXD  (via drill 0.3)
  Top 0.2: IC3.15 25.02,34.5 24.53,34.99 v24.53,35.09 | v24.54,36.91 24.54,37.25 25.59,38.3 25.59,42.7 25.34,42.95 25.34,47.1 25.63,47.4 IC2.12 31.13,47.4 31.48,47.75 31.48,50.85 31.12,51.21 CN1.5
  Bottom 0.2: v24.53,35.09 v24.53,36.9 v24.54,36.91

### Text on the board
tPlace: by blebox.eu
bPlace: by blebox.eu